# EAGLE design mains-driver (EAGLE 5.12)
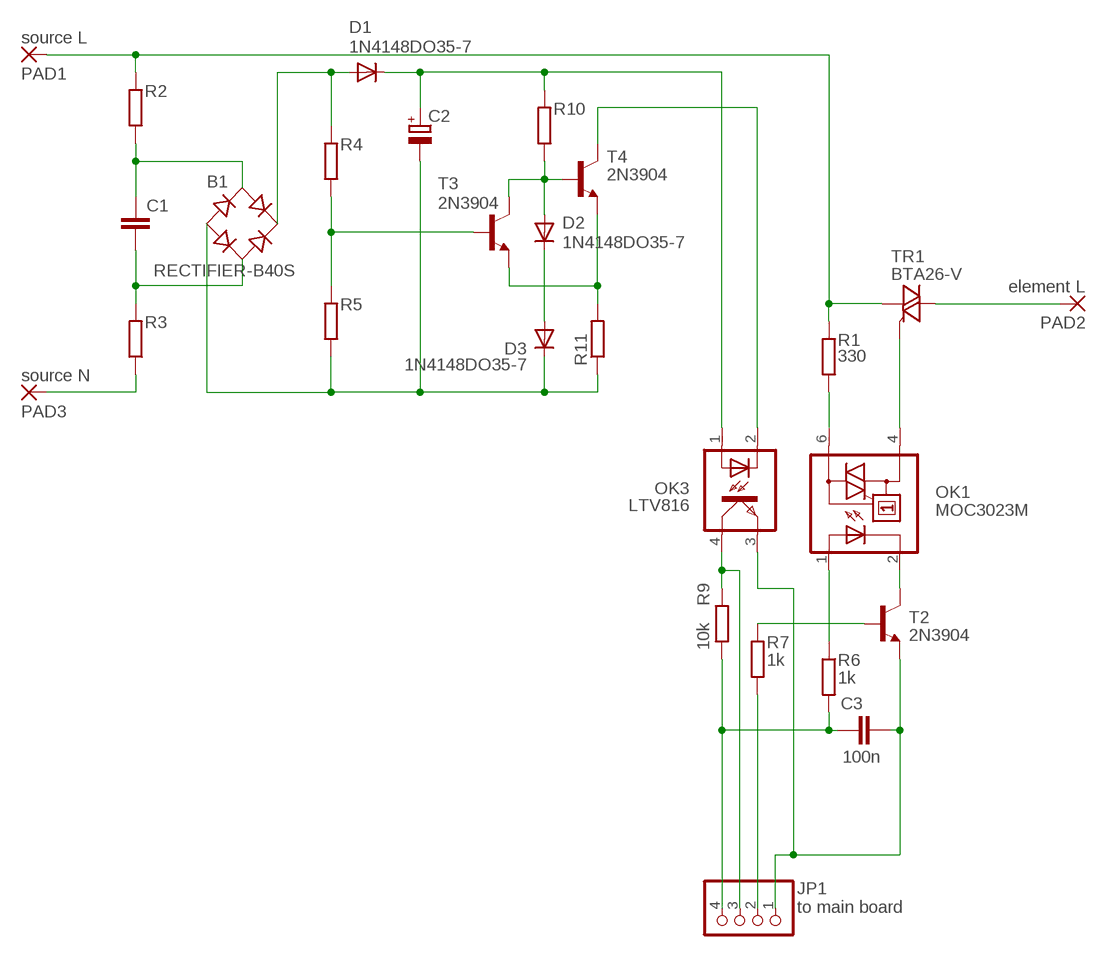
[diagram p0: schematic, sheet 1]

## Parts
B1  RECTIFIER-B40S  [B40S]
C1  C-EU050-045X075  [C050-045X075]
C2  CPOL-EUE2.5-6  [E2,5-6]
C3  100n  C-EU050-024X044  [C050-024X044]
D1  1N4148DO35-7  [DO35-7]
D2  1N4148DO35-7  [DO35-7]
D3  1N4148DO35-7  [DO35-7]
JP1  to main board  PINHD-1X4  [1X04]
OK1  MOC3023M  [DIL06]
OK3  LTV816  [DIL04]
PAD1  source L  3,81/1,4  [3,81/1,4]
PAD2  element L  3,81/1,4  [3,81/1,4]
PAD3  source N  3,81/1,4  [3,81/1,4]
R1  330  R-EU_0309/10  [0309/10]
R2  R-EU_0309/10  [0309/10]
R3  R-EU_0309/10  [0309/10]
R4  R-EU_0309/10  [0309/10]
R5  R-EU_0309/10  [0309/10]
R6  1k  R-EU_0207/10  [0207/10]
R7  1k  R-EU_0207/10  [0207/10]
R9  10k  R-EU_0207/10  [0207/10]
R10  R-EU_0309/10  [0309/10]
R11  R-EU_0309/10  [0309/10]
T2  2N3904  [TO92]
T3  2N3904  [TO92]
T4  2N3904  [TO92]
TR1  BTA26-V  [TOP3S-1]

## Nets
N$1: PAD1.1(P) R1.2 R2.2 TR1.A1
N$2: OK1.6(A2) R1.1
N$3: OK1.4(A1) TR1.G
N$4: PAD3.1(P) R3.1
N$5: PAD2.1(P) TR1.A2
N$6: OK1.2(C) T2.1(C)
N$7: C3.2 JP1.4 R6.2 R9.2
N$8: JP1.3 OK3.4(COL) R9.1
N$9: C3.1 JP1.1 OK3.3(EMIT) T2.3(E)
N$10: R7.1 T2.2(B)
N$11: JP1.2 R7.2
N$14: OK1.1(A) R6.1
N$15: B1.AC1 C1.1 R2.1
N$16: B1.AC2 C1.2 R3.2
N$17: B1.- C2.- D3.C R5.1 R11.1
N$18: B1.+ D1.A R4.2
N$19: R4.1 R5.2 T3.2(B)
N$20: C2.+ D1.C OK3.1(A) R10.2
N$21: R11.2 T3.3(E) T4.3(E)
N$22: D2.A R10.1 T3.1(C) T4.2(B)
N$24: D2.C D3.A
N$27: OK3.2(C) T4.1(C)

## Library data of the parts
B1 = rectifier:RECTIFIER-: Rectifier
C1 C3 = rcl:C-EU: CAPACITOR, European symbol
C2 = rcl:CPOL-EU: POLARIZED CAPACITOR, European symbol
D1-D3 = diode:1N4148: DIODE high speed (Philips)
JP1 = pinhead:PINHD-1X4: PIN HEADER
OK1 = optocoupler:MOC30*M: RANDOM-PHASE OPTOISOLATORS TRIAC DRIVER OUTPUT Source: http://www.fairchildsemi.com MOC3020-M.pdf; MF: FAIRCHILD SEMICONDUCTOR; MPN: MOC3023-M; OC_FARNELL: 1021367; OC_NEWARK: 72K8896
OK3 = optocoupler:LTV816: OPTO COUPLER Source: LITEON, LTV816.pdf; OC_FARNELL: unknown; OC_NEWARK: unknown
PAD1-PAD3 = wirepad:3,81/1,4: THROUGH-HOLE PAD
R1-R7 R9-R11 = rcl:R-EU_: RESISTOR, European symbol
T2-T4 = transistor:2N3904: NPN TRANSISTOR
TR1 = triac:BTA26: 25A TRIAC Source: http://www.st.com/stonline/products/literature/ds/7470.pdf

## Board
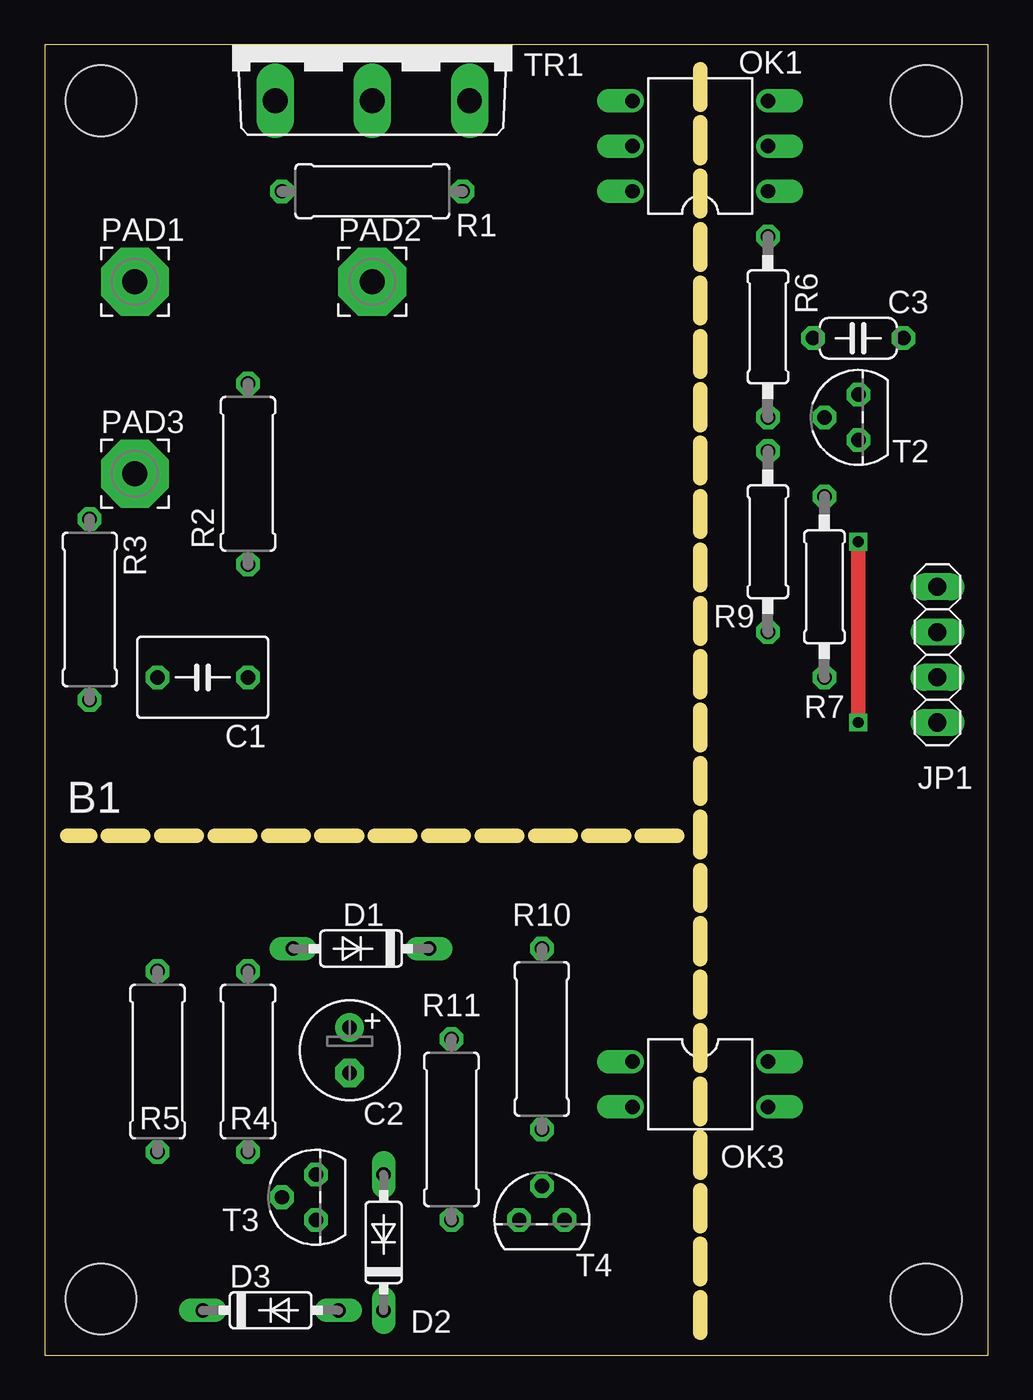
[diagram p1: board, top side]
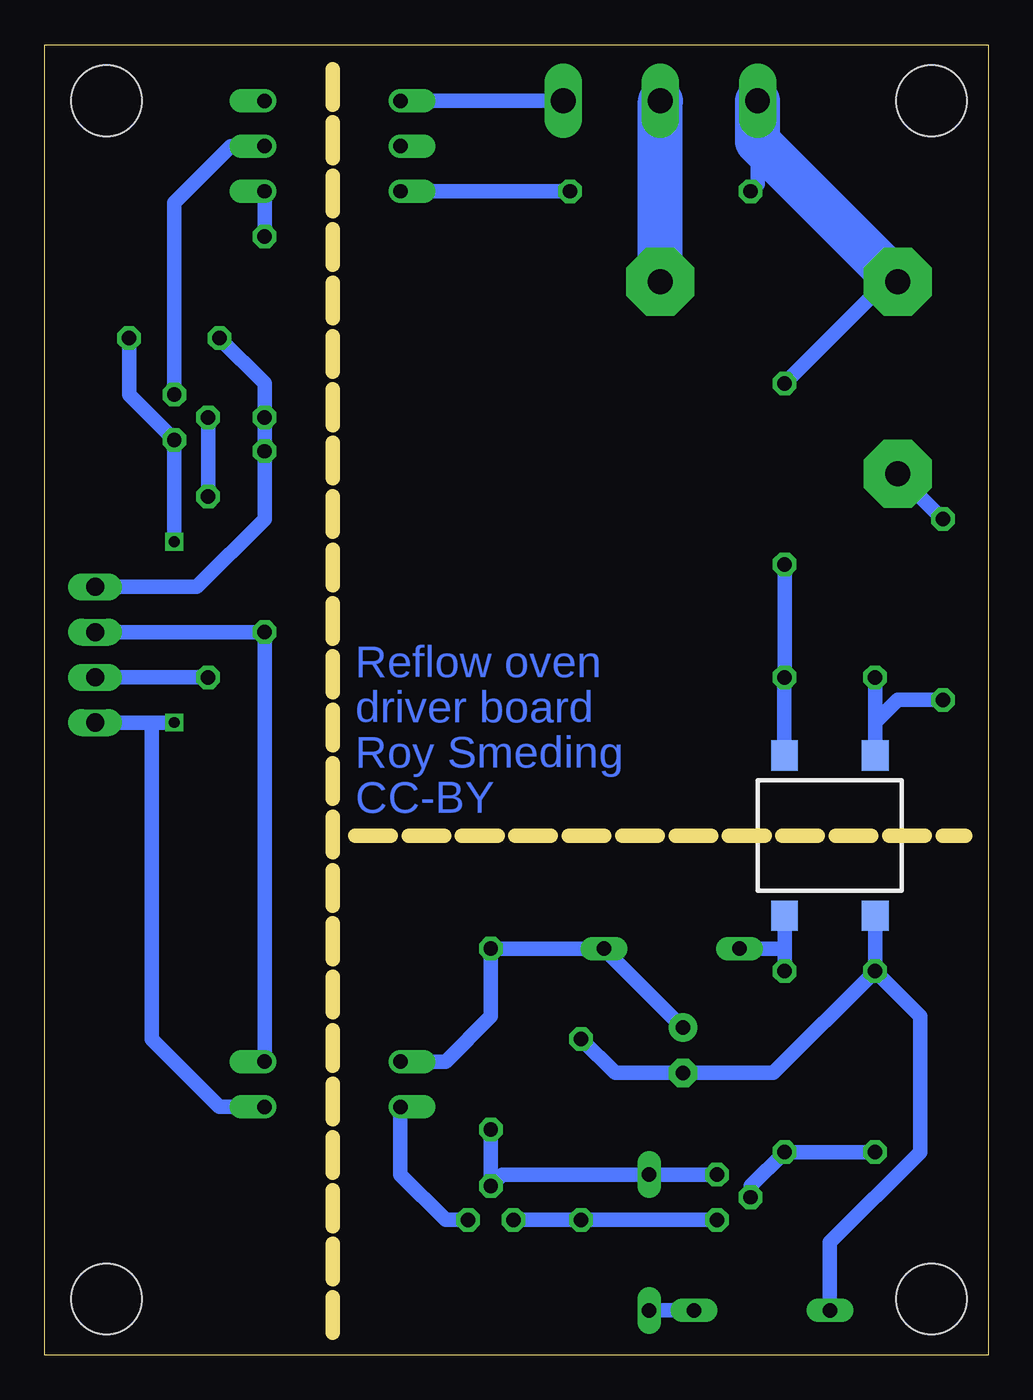
[diagram p2: board, bottom side, seen from below]

Size 53.01 x 73.65 mm. Coordinates in mm from the lower left corner, seen from the top.
Outline: 0,0 53.01,0 53.01,73.65 0,73.65 0,0
Copper layers (1*16): Top 0.035mm / dielectric 1.5mm / Bottom 0.035mm
Design rules "default": minimum track width 10mil, minimum drill 24mil, track to track 8mil, track to pad 8mil, pad to pad 8mil, via to via 8mil, smd to smd 8mil, copper to edge 40mil, drill to drill 8mil, minimum pad ring 10mil, minimum via ring 8mil, stop-mask expansion 4mil, vias tented up to drill 0mil, thermal gap 10mil
Holes 3.99 mm at 3.17,70.48 49.53,70.48 3.17,3.17 49.53,3.17
Milling: 36 lines

### Footprints (pad centres in the part's own frame; a part is rotated, then mirrored left to right if it is on the bottom)
B40S = smd 1.5 x 1.7: + -2.55,-4.5; - 2.55,-4.5; AC1 -2.55,4.5; AC2 2.55,4.5
C050-045X075 = drill 0.813 octagon: 1 -2.54,0; 2 2.54,0
E2,5-6 = drill 0.813 pad 1.6 round: + -1.27,0 | drill 0.813 pad 1.6 octagon: - 1.27,0
C050-024X044 = drill 0.813 octagon: 1 -2.54,0; 2 2.54,0
DO35-7 = drill 0.813 long: A 3.81,0; C -3.81,0
1X04 = drill 1.016 long: 1 -3.81,0; 2 -1.27,0; 3 1.27,0; 4 3.81,0
DIL06 = drill 0.813 offset: 1 -2.54,-3.81; 2 0,-3.81; 3 2.54,-3.81; 4 2.54,3.81; 5 0,3.81; 6 -2.54,3.81
DIL04 = drill 0.813 offset: 1 -1.27,-3.81; 2 1.27,-3.81; 3 1.27,3.81; 4 -1.27,3.81
3,81/1,4 = drill 1.397 pad 3.81 octagon: 1 0,0
0309/10 = drill 0.813 octagon: 1 -5.08,0; 2 5.08,0
0207/10 = drill 0.813 octagon: 1 -5.08,0; 2 5.08,0
TO92 = drill 0.813 octagon: 1 1.27,0; 2 0,1.905; 3 -1.27,0
TOP3S-1 = drill 1.397 long: A1 -5.461,-3.175; A2 0,-3.175; G 5.461,-3.175

### Placement (x,y rotation side)
B1  8.89,29.21 0 bottom
C1  8.89,38.1 180 top
C2  17.14,17.14 270 top
C3  45.72,57.15 180 top
D1  17.78,22.86 180 top
D2  19.05,6.35 90 top
D3  12.7,2.54 0 top
JP1  50.16,39.37 90 top
OK1  36.83,67.94 90 top
OK3  36.83,15.24 270 top
PAD1  5.08,60.33 0 top
PAD2  18.41,60.33 0 top
PAD3  5.08,49.53 0 top
R1  18.41,65.41 180 top
R2  11.43,49.53 90 top
R3  2.54,41.91 270 top
R4  11.43,16.51 90 top
R5  6.35,16.51 270 top
R6  40.64,57.78 270 top
R7  43.81,43.18 270 top
R9  40.64,45.72 90 top
R10  27.94,17.78 90 top
R11  22.86,12.7 270 top
T2  45.72,52.7 90 top
T3  15.24,8.89 90 top
T4  27.94,7.62 0 top
TR1  18.41,73.66 0 top

### Tracks (layer width: path | path; a pad name or v marks a point on that pad's centre or on a via)
N$1
  Bottom 0.813: R1.2 12.95,65.79 TR1.A1 | R2.2 5.71,60.33 PAD1.1
  Bottom 2.54: TR1.A1 12.95,68.2 PAD1.1
N$2
  Bottom 0.813: R1.1 OK1.6
N$3
  Bottom 0.813: TR1.G OK1.4
N$4
  Bottom 0.813: R3.1 PAD3.1
N$5
  Bottom 2.54: PAD2.1 TR1.A2
N$6
  Bottom 0.813: OK1.2 42.55,67.94 45.72,64.77 T2.1
N$7
  Bottom 0.813: JP1.4 44.45,43.18 40.64,46.99 R9.2 R6.2 40.64,54.61 C3.2
N$8
  Bottom 0.813: JP1.3 R9.1 OK3.4
N$9  (via drill 0.6)
  Top 0.813: v45.72,35.56 v45.72,45.72
  Bottom 0.813: 46.99,35.56 JP1.1 | 46.99,35.56 v45.72,35.56 | v45.72,45.72 T2.3 48.26,53.98 C3.1 | OK3.3 43.18,13.97 46.99,17.78 46.99,35.56
N$10
  Bottom 0.813: T2.2 R7.1
N$11
  Bottom 0.813: JP1.2 R7.2
N$14
  Bottom 0.813: OK1.1 R6.1
N$15
  Bottom 0.813: R2.1 C1.1 B1.AC1
N$16
  Bottom 0.813: R3.2 5.08,36.83 6.34,35.57 | B1.AC2 6.34,35.57 | C1.2 6.34,35.57
N$17
  Bottom 0.813: B1.- R5.1 | D3.C 8.89,6.35 3.81,11.43 3.81,19.05 R5.1 | R11.1 20.95,15.88 C2.- 12.06,15.88 R5.1
N$18
  Bottom 0.813: B1.+ 11.43,22.86 | R4.2 11.43,22.86 | 11.43,22.86 D1.A
N$19
  Bottom 0.813: R5.2 R4.1 13.34,9.53 T3.2
N$20
  Bottom 0.813: OK3.1 30.48,16.51 27.94,19.05 R10.2 D1.C C2.+
N$21
  Bottom 0.813: T3.3 R11.2 T4.3
N$22
  Bottom 0.813: T3.1 D2.A 27.3,10.16 T4.2 R10.1
N$24
  Bottom 0.813: D3.A D2.C
N$27
  Bottom 0.813: T4.1 30.48,7.62 33.02,10.16 OK3.2

### Text on the board
Bottom: Reflow oven | driver board | Roy Smeding | CC-BY